# Altium schematic sheet nanoga_mezz_top.SchDoc: =ProjectName
size 420 x 297 mm; Author: SBH; CompanyName: WUT; DrawnBy: SBH; Organization: ISE-WUT; Address1: Warsaw Univeristy of Technology; Address2: Nowowiejska 15/19; Revision: -; SheetNumber: 1; EDA_Number: ARTIQ; Projet: ADC/DAC MEZZANINE; ModifiedBy: -; CreateDate: XX/XX/XXXX; CheckedDate: -; Title2: nanoga_mezz_top.SchDoc; DivGrp: ISE; Designer: SBH; ModifiedDate: -; ProjectName: ADC/DAC MEZZANINE
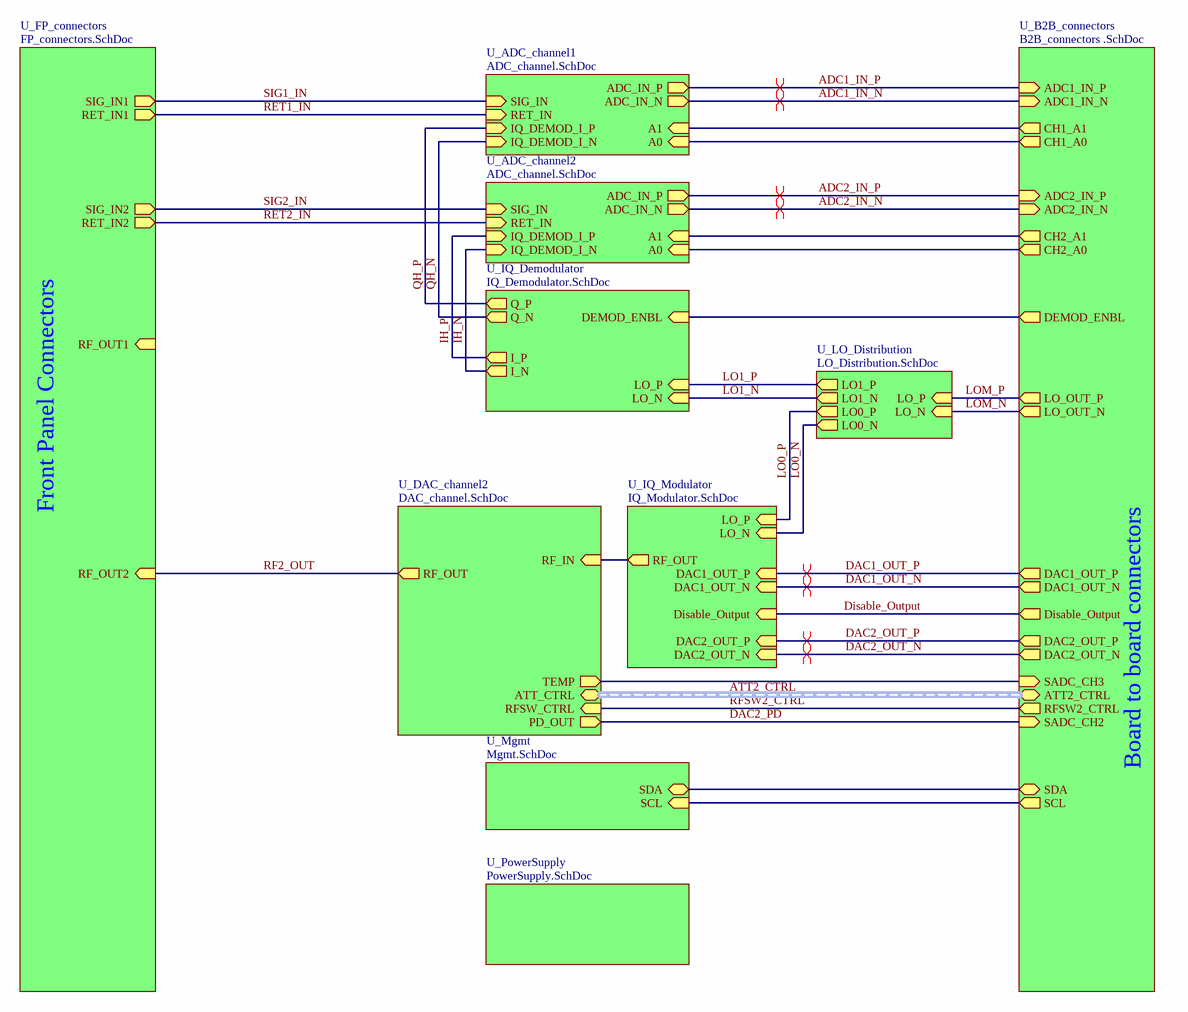
[diagram p0: nanoga_mezz_top.SchDoc]

## Sub-sheets
U_ADC_channel1 = ADC_channel.SchDoc: ADC_IN_N (out), ADC_IN_P (out), SIG_IN (in), RET_IN (in), A1 (in), A0 (in), IQ_DEMOD_I_N (in), IQ_DEMOD_I_P (in)
U_ADC_channel2 = ADC_channel.SchDoc: ADC_IN_P (out), ADC_IN_N (out), SIG_IN (in), RET_IN (in), A1 (in), A0 (in), IQ_DEMOD_I_N (in), IQ_DEMOD_I_P (in)
U_B2B_connectors = B2B_connectors .SchDoc: ADC1_IN_N (in), ADC1_IN_P (in), DAC1_OUT_N (out), DAC1_OUT_P (out), DAC2_OUT_N (out), DAC2_OUT_P (out), ADC2_IN_N (in), ADC2_IN_P (in), ATT2_CTRL (harness ATT_CTRL), RFSW2_CTRL (out), SDA (bidir), SCL (out), SADC_CH2 (in), CH1_A0 (out), CH2_A1 (out), CH1_A1 (out), CH2_A0 (out), SADC_CH3 (in), LO_OUT_N (out), LO_OUT_P (out), Disable_Output (out), DEMOD_ENBL (out)
U_DAC_channel2 = DAC_channel.SchDoc: RF_OUT (out), RFSW_CTRL (in), ATT_CTRL (harness ATT_CTRL), PD_OUT (out), TEMP (out), RF_IN (in)
U_FP_connectors = FP_connectors.SchDoc: RF_OUT1 (in), RF_OUT2 (in), SIG_IN1 (out), SIG_IN2 (out), RET_IN1 (out), RET_IN2 (out)
U_IQ_Demodulator = IQ_Demodulator.SchDoc: I_P (out), I_N (out), Q_P (out), Q_N (out), LO_P (in), LO_N (in), DEMOD_ENBL (in)
U_IQ_Modulator = IQ_Modulator.SchDoc: DAC1_OUT_P (in), DAC1_OUT_N (in), RF_OUT (out), DAC2_OUT_P (in), DAC2_OUT_N (in), LO_P (in), LO_N (in), Disable_Output (in)
U_LO_Distribution = LO_Distribution.SchDoc: LO_P (in), LO_N (in), LO1_P (out), LO1_N (out), LO0_N (out), LO0_P (out)
U_Mgmt = Mgmt.SchDoc: SDA (bidir), SCL (in)
U_PowerSupply = PowerSupply.SchDoc: no entries

## Nets
ADC1_IN_N: sheet U_ADC_channel1/ADC_IN_N, sheet U_B2B_connectors/ADC1_IN_N
ADC1_IN_P: sheet U_ADC_channel1/ADC_IN_P, sheet U_B2B_connectors/ADC1_IN_P
ADC2_IN_N: sheet U_ADC_channel2/ADC_IN_N, sheet U_B2B_connectors/ADC2_IN_N
ADC2_IN_P: sheet U_ADC_channel2/ADC_IN_P, sheet U_B2B_connectors/ADC2_IN_P
DAC1_OUT_N: sheet U_B2B_connectors/DAC1_OUT_N, sheet U_IQ_Modulator/DAC1_OUT_N
DAC1_OUT_P: sheet U_B2B_connectors/DAC1_OUT_P, sheet U_IQ_Modulator/DAC1_OUT_P
DAC2_OUT_N: sheet U_B2B_connectors/DAC2_OUT_N, sheet U_IQ_Modulator/DAC2_OUT_N
DAC2_OUT_P: sheet U_B2B_connectors/DAC2_OUT_P, sheet U_IQ_Modulator/DAC2_OUT_P
DAC2_PD: sheet U_DAC_channel2/PD_OUT, sheet U_B2B_connectors/SADC_CH2
Disable_Output: sheet U_B2B_connectors/Disable_Output, sheet U_IQ_Modulator/Disable_Output
IH_N: sheet U_ADC_channel2/IQ_DEMOD_I_N, sheet U_IQ_Demodulator/I_N
IH_P: sheet U_ADC_channel2/IQ_DEMOD_I_P, sheet U_IQ_Demodulator/I_P
LO0_N: sheet U_IQ_Modulator/LO_N, sheet U_LO_Distribution/LO0_N
LO0_P: sheet U_IQ_Modulator/LO_P, sheet U_LO_Distribution/LO0_P
LO1_N: sheet U_LO_Distribution/LO1_N, sheet U_IQ_Demodulator/LO_N
LO1_P: sheet U_LO_Distribution/LO1_P, sheet U_IQ_Demodulator/LO_P
LOM_N: sheet U_B2B_connectors/LO_OUT_N, sheet U_LO_Distribution/LO_N
LOM_P: sheet U_B2B_connectors/LO_OUT_P, sheet U_LO_Distribution/LO_P
QH_N: sheet U_ADC_channel1/IQ_DEMOD_I_N, sheet U_IQ_Demodulator/Q_N
QH_P: sheet U_ADC_channel1/IQ_DEMOD_I_P, sheet U_IQ_Demodulator/Q_P
RET1_IN: sheet U_ADC_channel1/RET_IN, sheet U_FP_connectors/RET_IN1
RET2_IN: sheet U_ADC_channel2/RET_IN, sheet U_FP_connectors/RET_IN2
RF2_OUT: sheet U_DAC_channel2/RF_OUT, sheet U_FP_connectors/RF_OUT2
RFSW2_CTRL: sheet U_DAC_channel2/RFSW_CTRL, sheet U_B2B_connectors/RFSW2_CTRL
SIG1_IN: sheet U_ADC_channel1/SIG_IN, sheet U_FP_connectors/SIG_IN1
SIG2_IN: sheet U_ADC_channel2/SIG_IN, sheet U_FP_connectors/SIG_IN2
(unnamed): sheet U_ADC_channel1/A1, sheet U_B2B_connectors/CH1_A1
(unnamed): sheet U_ADC_channel1/A0, sheet U_B2B_connectors/CH1_A0
(unnamed): sheet U_ADC_channel2/A1, sheet U_B2B_connectors/CH2_A1
(unnamed): sheet U_ADC_channel2/A0, sheet U_B2B_connectors/CH2_A0
(unnamed): sheet U_DAC_channel2/TEMP, sheet U_B2B_connectors/SADC_CH3
(unnamed): sheet U_DAC_channel2/RF_IN, sheet U_IQ_Modulator/RF_OUT
(unnamed): sheet U_B2B_connectors/SDA, sheet U_Mgmt/SDA
(unnamed): sheet U_B2B_connectors/SCL, sheet U_Mgmt/SCL
(unnamed): sheet U_B2B_connectors/DEMOD_ENBL, sheet U_IQ_Demodulator/DEMOD_ENBL

## Buses and harness runs
harness ATT2_CTRL = sheet U_B2B_connectors/ATT2_CTRL = sheet U_DAC_channel2/ATT_CTRL

## Layout directives
differential pair: ADC1_IN_N, ADC1_IN_P, ADC2_IN_N, ADC2_IN_P, DAC1_OUT_N, DAC1_OUT_P, DAC2_OUT_N, DAC2_OUT_P

## Notes on the sheet
- Front Panel Connectors
- Board to board connectors
- Project/Equipment
- Document
- Designer
- Drawn by
- Check.by
- File
- Last Mod.
- Print Date
- Sheet
- Size
- A3
- of
- Rev